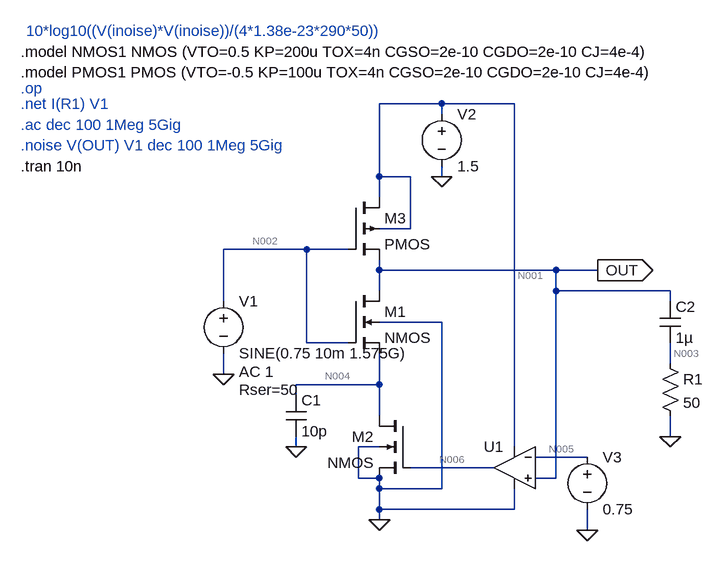
[diagram p0: schematic Draft1.asc]
Draft1.asc, the LTspice schematic file:
Version 4.1
SHEET 1 880 680
WIRE 304 -272 208 -272
WIRE 416 -272 304 -272
WIRE 304 -256 304 -272
WIRE 208 -160 208 -272
WIRE 256 -160 208 -160
WIRE 304 -160 304 -176
WIRE 208 -128 208 -160
WIRE 256 -80 256 -160
WIRE 256 -80 208 -80
WIRE 96 -48 -32 -48
WIRE 160 -48 96 -48
WIRE 208 -16 208 -32
WIRE 480 -16 208 -16
WIRE 544 -16 480 -16
WIRE 208 16 208 -16
WIRE 480 16 480 -16
WIRE 656 16 480 16
WIRE -32 32 -32 -48
WIRE 656 32 656 16
WIRE 304 64 208 64
WIRE 96 96 96 -48
WIRE 160 96 96 96
WIRE 656 128 656 96
WIRE -32 144 -32 112
WIRE 208 160 208 112
WIRE 208 160 80 160
WIRE 80 176 80 160
WIRE 208 208 208 160
WIRE 656 240 656 208
WIRE 80 256 80 240
WIRE 208 256 176 256
WIRE 416 256 416 -272
WIRE 528 272 448 272
WIRE 384 288 256 288
WIRE 176 304 176 256
WIRE 208 304 176 304
WIRE 480 304 480 16
WIRE 480 304 448 304
WIRE 208 320 208 304
WIRE 304 320 304 64
WIRE 304 320 208 320
WIRE 208 352 208 320
WIRE 416 352 416 320
WIRE 416 352 208 352
WIRE 208 368 208 352
WIRE 528 384 528 352
FLAG -32 144 0
FLAG 304 -160 0
FLAG 528 384 0
FLAG 80 256 0
FLAG 544 -16 OUT
IOPIN 544 -16 Out
FLAG 208 368 0
FLAG 656 240 0
SYMBOL nmos4 160 16 R0
SYMATTR InstName M1
SYMATTR Value2 l=100n w=100u
SYMBOL nmos4 256 208 M0
SYMATTR InstName M2
SYMATTR Value2 l=100n w=100u
SYMBOL pmos4 160 -128 R0
SYMATTR InstName M3
SYMATTR Value2 l=100n w=10u
SYMBOL voltage -32 16 R0
WINDOW 123 24 124 Left 2
WINDOW 39 24 152 Left 2
SYMATTR Value2 AC 1
SYMATTR SpiceLine Rser=50
SYMATTR InstName V1
SYMATTR Value SINE(0.75 10m 1.575G)
SYMBOL voltage 304 -272 R0
WINDOW 123 0 0 Left 0
WINDOW 39 0 0 Left 0
SYMATTR InstName V2
SYMATTR Value 1.5
SYMBOL voltage 528 256 R0
WINDOW 123 0 0 Left 0
WINDOW 39 0 0 Left 0
SYMATTR InstName V3
SYMATTR Value 0.75
SYMBOL cap 64 176 R0
SYMATTR InstName C1
SYMATTR Value 10p
SYMBOL res 640 112 R0
SYMATTR InstName R1
SYMATTR Value 50
SYMBOL cap 640 32 R0
SYMATTR InstName C2
SYMATTR Value 1µ
SYMBOL OpAmps\\UniversalOpAmp2 416 288 M0
SYMATTR InstName U1
SYMATTR Value2 Avol=100k GBW=10Meg Slew=10Meg
TEXT -344 -352 Left 2 !.model NMOS1 NMOS (VTO=0.5 KP=200u TOX=4n CGSO=2e-10 CGDO=2e-10 CJ=4e-4)\n.model PMOS1 PMOS (VTO=-0.5 KP=100u TOX=4n CGSO=2e-10 CGDO=2e-10 CJ=4e-4)
TEXT -344 -296 Left 2 ;.op
TEXT -344 -272 Left 2 ;.net I(R1) V1
TEXT -344 -240 Left 2 ;.ac dec 100 1Meg 5Gig
TEXT -344 -208 Left 2 ;.noise V(OUT) V1 dec 100 1Meg 5Gig
TEXT -336 -384 Left 2 ;10*log10((V(inoise)*V(inoise))/(4*1.38e-23*290*50))
TEXT -344 -176 Left 2 !.tran 10n

The netlist it stands for:
* Draft1.asc
M1 OUT N002 N004 0 NMOS l=100n w=100u
M2 N004 N006 0 0 NMOS l=100n w=100u
M3 N001 N002 OUT N001 PMOS l=100n w=10u
V1 N002 0 SINE(0.75 10m 1.575G) AC 1 Rser=50
V2 N001 0 1.5
V3 N005 0 0.75
C1 N004 0 10p
R1 N003 0 50
C2 OUT N003 1µ
X§U1 OUT N005 N001 0 N006 level2 Avol=100k GBW=10Meg Slew=10Meg Ilimit=25m Rail=0 Vos=0 En=0 Enk=0 In=0 Ink=0 Rin=500Meg  ; pins In+ In- V+ V- OUT
.model NMOS NMOS
.model PMOS PMOS
.lib standard.mos
.model NMOS1 NMOS (VTO=0.5 KP=200u TOX=4n CGSO=2e-10 CGDO=2e-10 CJ=4e-4)
.model PMOS1 PMOS (VTO=-0.5 KP=100u TOX=4n CGSO=2e-10 CGDO=2e-10 CJ=4e-4)
* .op
* .net I(R1) V1
* .ac dec 100 1Meg 5Gig
* .noise V(OUT) V1 dec 100 1Meg 5Gig
* 10*log10((V(inoise)*V(inoise))/(4*1.38e-23*290*50))
.tran 10n
.lib UniversalOpAmp2.lib
.backanno
.end

* Results of the author's LTspice run, read from the files saved beside the schematic
* Operating Point, zero values left out:
*   V(n001) = 1.5 V
*   V(n002) = 750 mV
*   V(n004) = 512.8 mV
*   V(n005) = 750 mV
*   V(n006) = 237.2 mV
*   V(out) = 750 mV
*   I(V2) = -617.2 µA
*   Ib(M1) = -1.283 pA
*   Id(M1) = 562.5 µA
*   Id(M2) = 562.5 µA
*   Id(M3) = 562.5 µA
*   Is(M1) = -562.5 µA
*   Is(M2) = -562.5 µA
*   Is(M3) = -562.5 µA
*   Ix(u1:3) = 54.73 µA
*   Ix(u1:4) = -54.73 µA
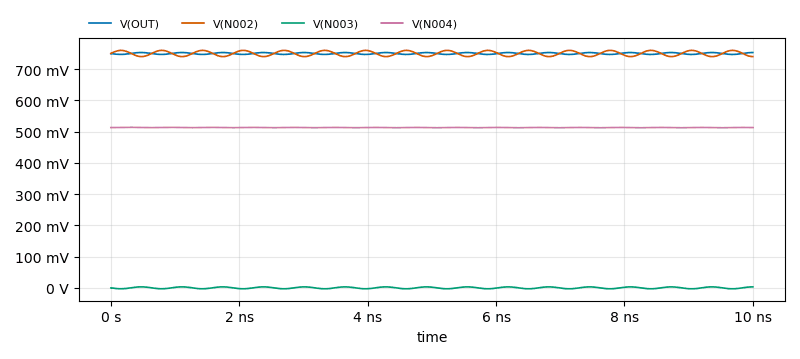
[diagram p1: Transient Analysis of Draft1.asc, plotted from the saved traces]
* Transient Analysis, 1 run:
*   V(OUT): min 746.9 mV, max 753.1 mV, average 750 mV, rms 750 mV, last 753.1 mV
*   V(N002): min 740 mV, max 760 mV, average 750.1 mV, rms 750.1 mV, last 740 mV
*   V(N003): min -3.069 mV, max 3.15 mV, average -5.58 µV, rms 2.176 mV, last 3.069 mV
*   V(N004): min 512.4 mV, max 513.7 mV, average 513 mV, rms 513 mV, last 512.8 mV